# EAGLE schematic obc_old (EAGLE 9.5.0)
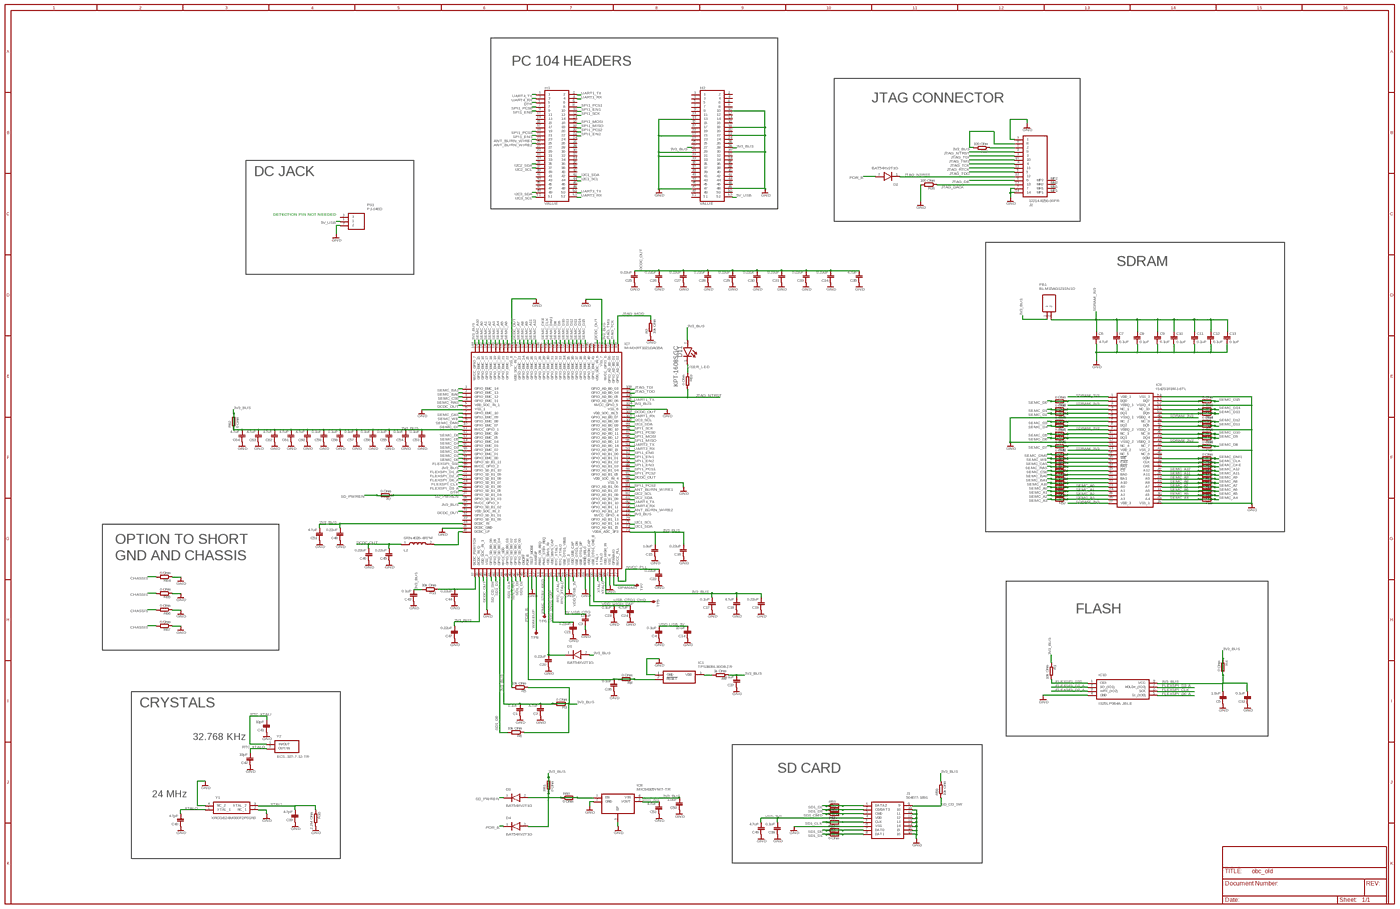
[diagram p0: schematic, sheet 1, overview]
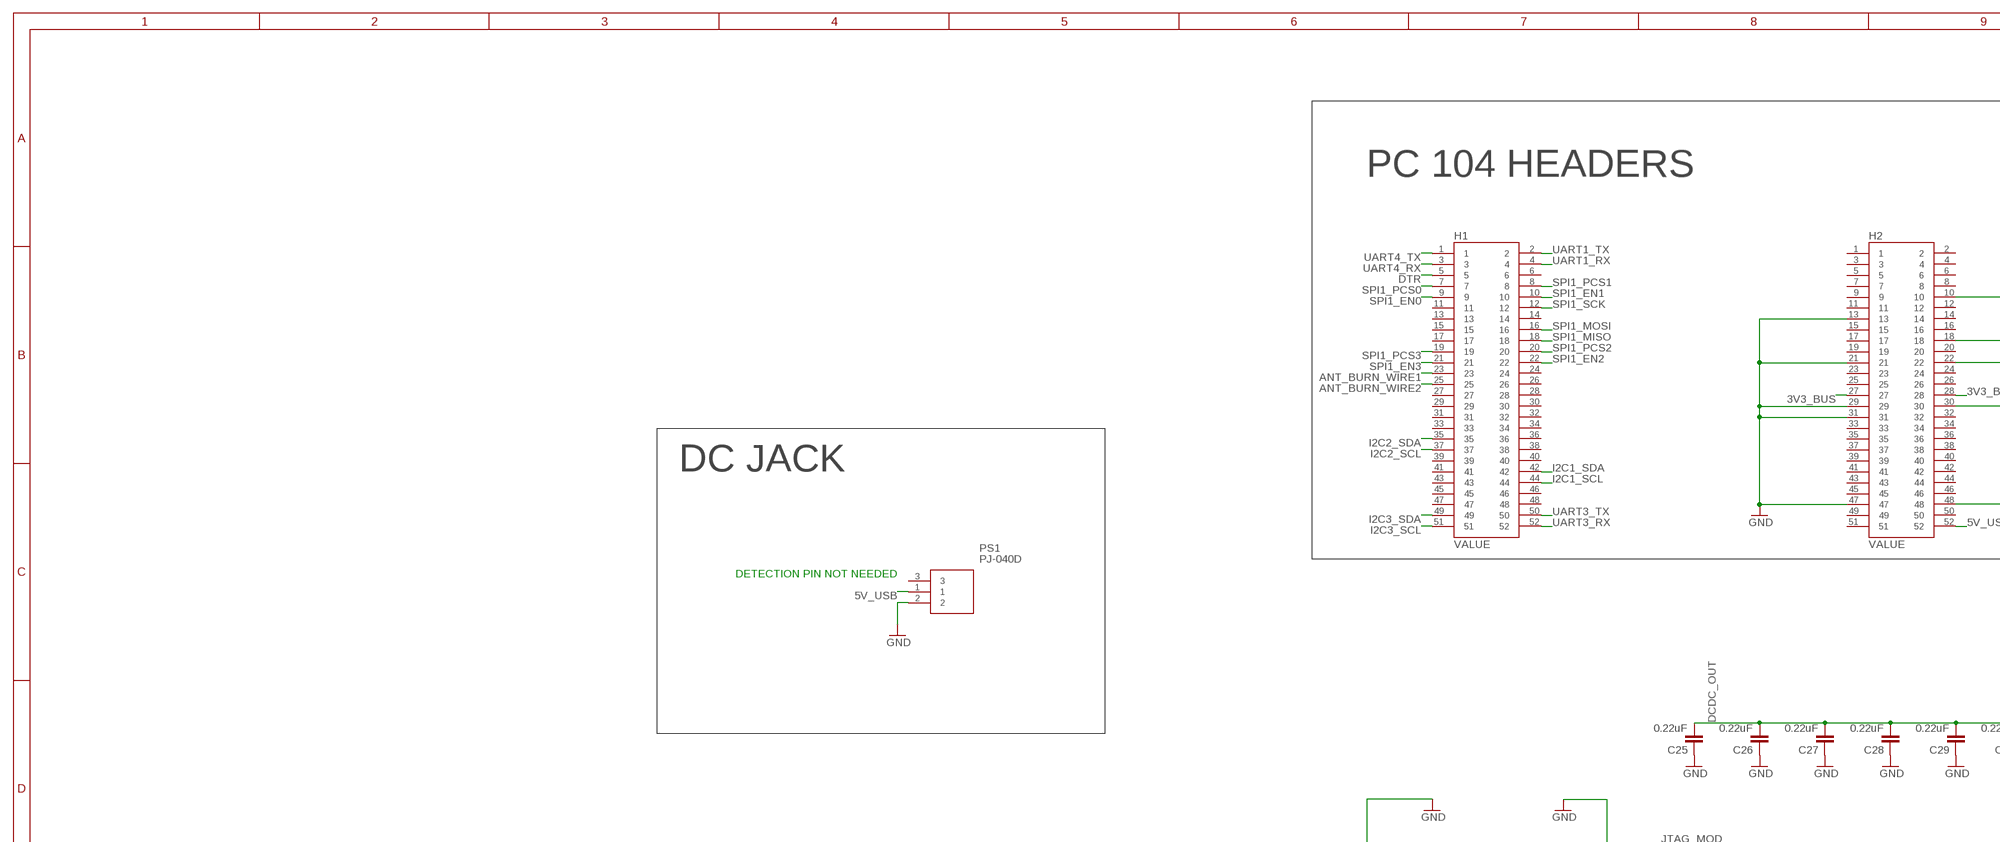
[diagram p1: schematic, sheet 1, part 1 of 4]
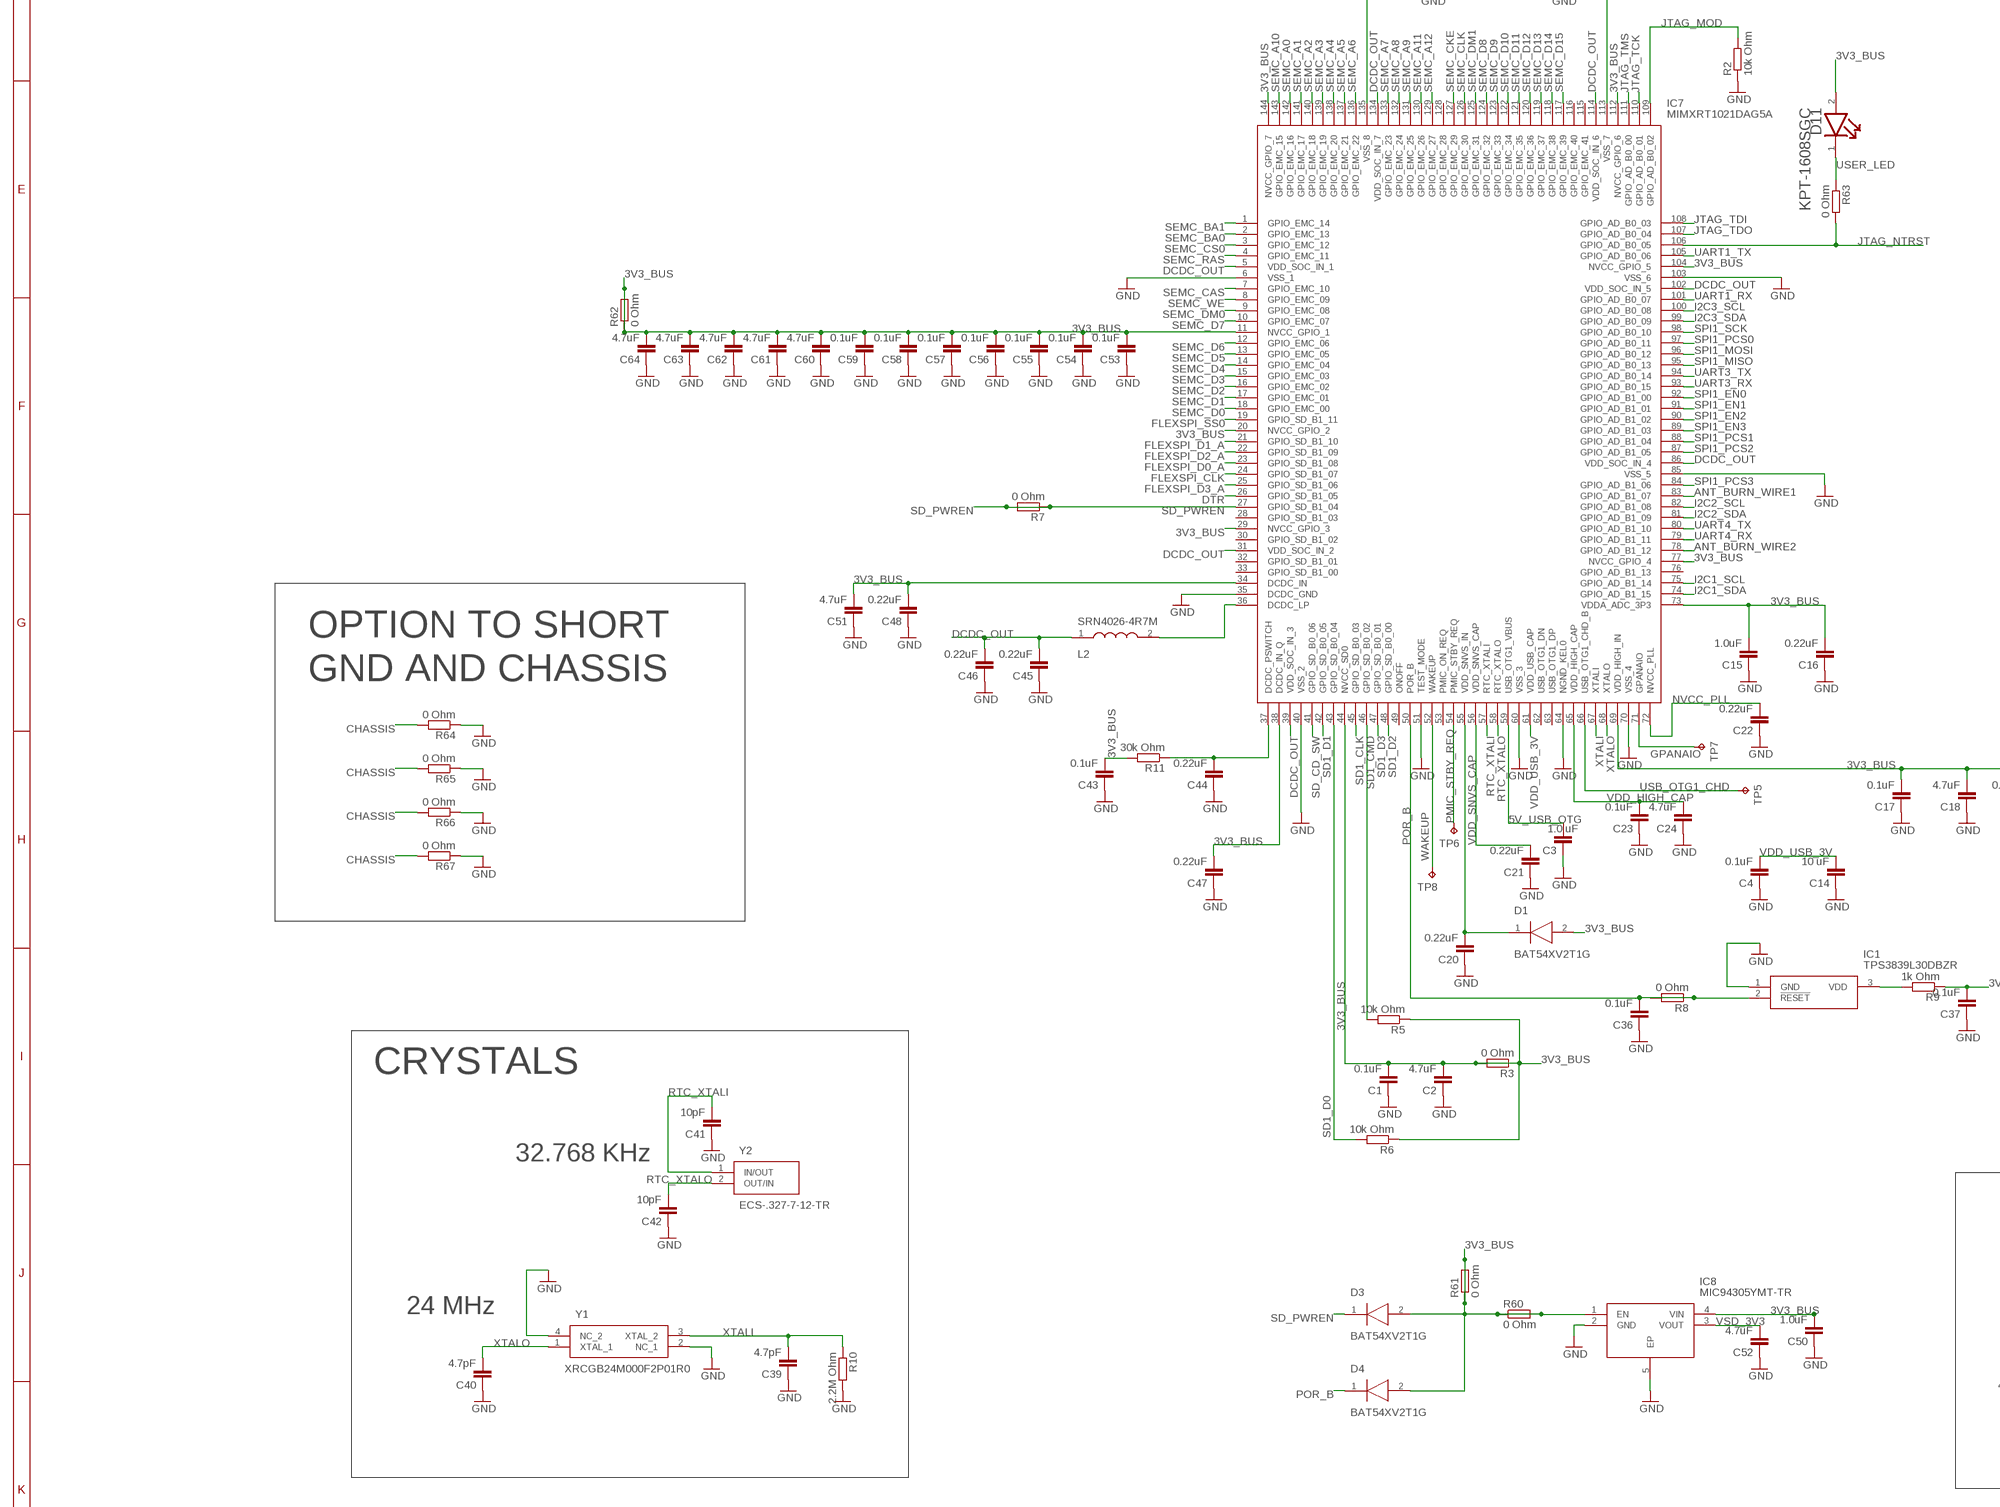
[diagram p2: schematic, sheet 1, part 2 of 4]
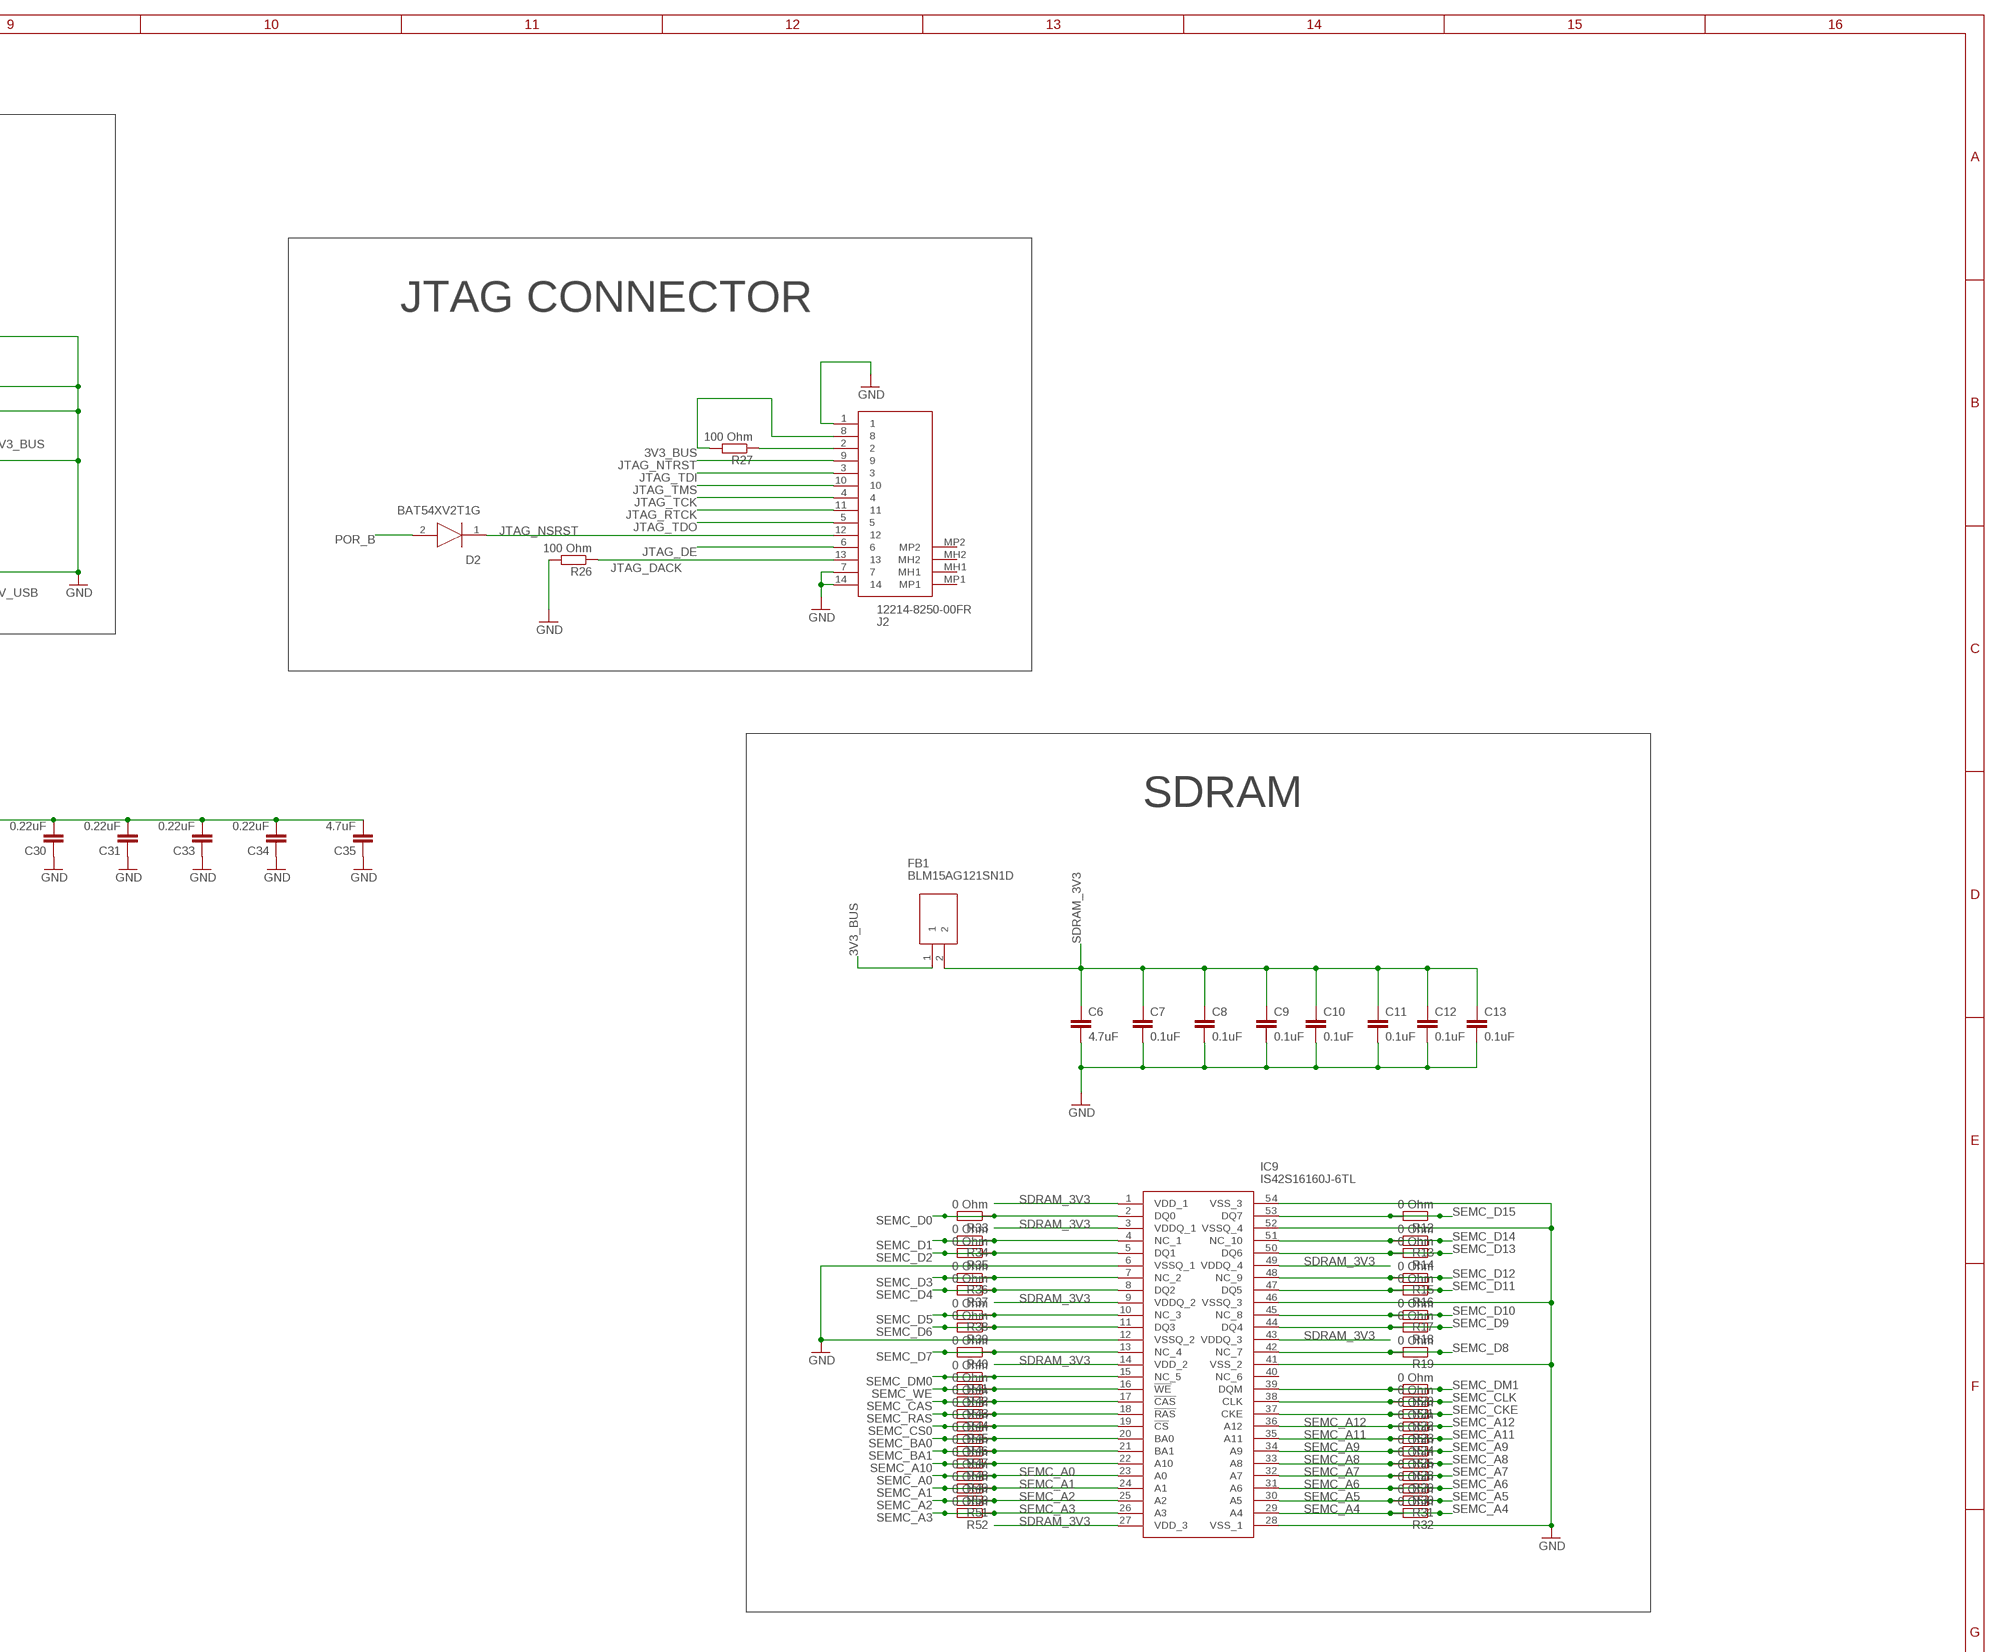
[diagram p3: schematic, sheet 1, part 3 of 4]
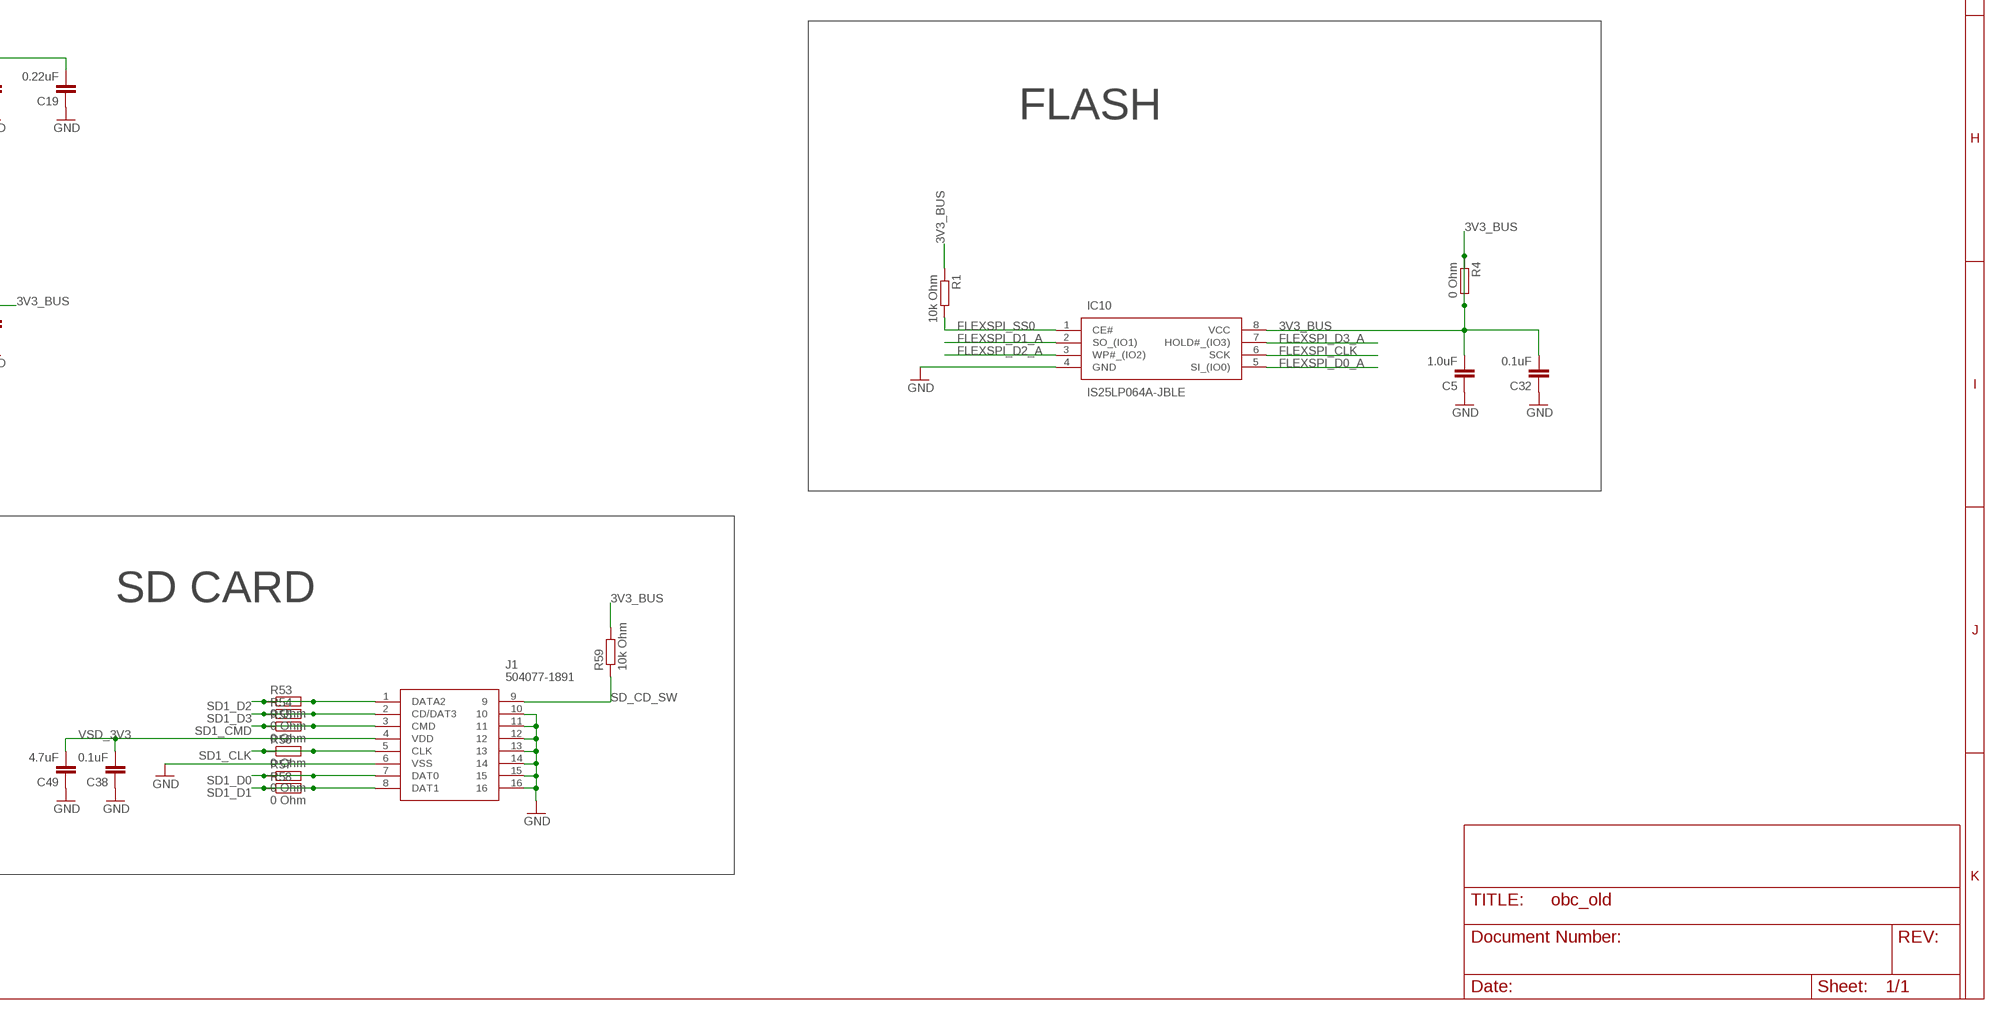
[diagram p4: schematic, sheet 1, part 4 of 4]

## Parts
C1  0.1uF  C-EUC0402K  [C0402K]
C2  4.7uF  C-EUC0402K  [C0402K]
C3  1.0 uF  C-EUC0402K  [C0402K]
C4  0.1uF  C-EUC0402K  [C0402K]
C5  1.0uF  C-EUC0402K  [C0402K]
C6  4.7uF  C-EUC0402K  [C0402K]
C7  0.1uF  C-EUC0402K  [C0402K]
C8  0.1uF  C-EUC0402K  [C0402K]
C9  0.1uF  C-EUC0402K  [C0402K]
C10  0.1uF  C-EUC0402K  [C0402K]
C11  0.1uF  C-EUC0402K  [C0402K]
C12  0.1uF  C-EUC0402K  [C0402K]
C13  0.1uF  C-EUC0402K  [C0402K]
C14  10 uF  C-EUC0402K  [C0402K]
C15  1.0uF  C-EUC0402K  [C0402K]
C16  0.22uF  C-EUC0402K  [C0402K]
C17  0.1uF  C-EUC0402K  [C0402K]
C18  4.7uF  C-EUC0402K  [C0402K]
C19  0.22uF  C-EUC0402K  [C0402K]
C20  0.22uF  C-EUC0402K  [C0402K]
C21  0.22uF  C-EUC0402K  [C0402K]
C22  0.22uF  C-EUC0402K  [C0402K]
C23  0.1uF  C-EUC0402K  [C0402K]
C24  4.7uF  C-EUC0402K  [C0402K]
C25  0.22uF  C-EUC0402K  [C0402K]
C26  0.22uF  C-EUC0402K  [C0402K]
C27  0.22uF  C-EUC0402K  [C0402K]
C28  0.22uF  C-EUC0402K  [C0402K]
C29  0.22uF  C-EUC0402K  [C0402K]
C30  0.22uF  C-EUC0402K  [C0402K]
C31  0.22uF  C-EUC0402K  [C0402K]
C32  0.1uF  C-EUC0402K  [C0402K]
C33  0.22uF  C-EUC0402K  [C0402K]
C34  0.22uF  C-EUC0402K  [C0402K]
C35  4.7uF  C-EUC0402K  [C0402K]
C36  0.1uF  C-EUC0402K  [C0402K]
C37  0.1uF  C-EUC0402K  [C0402K]
C38  0.1uF  C-EUC0402K  [C0402K]
C39  4.7pF  C-EUC0402K  [C0402K]
C40  4.7pF  C-EUC0402K  [C0402K]
C41  10pF  C-EUC0402K  [C0402K]
C42  10pF  C-EUC0402K  [C0402K]
C43  0.1uF  C-EUC0402K  [C0402K]
C44  0.22uF  C-EUC0402K  [C0402K]
C45  0.22uF  C-EUC0402K  [C0402K]
C46  0.22uF  C-EUC0402K  [C0402K]
C47  0.22uF  C-EUC0402K  [C0402K]
C48  0.22uF  C-EUC0402K  [C0402K]
C49  4.7uF  C-EUC0402K  [C0402K]
C50  1.0uF  C-EUC0402K  [C0402K]
C51  4.7uF  C-EUC0402K  [C0402K]
C52  4.7uF  C-EUC0402K  [C0402K]
C53  0.1uF  C-EUC0402K  [C0402K]
C54  0.1uF  C-EUC0402K  [C0402K]
C55  0.1uF  C-EUC0402K  [C0402K]
C56  0.1uF  C-EUC0402K  [C0402K]
C57  0.1uF  C-EUC0402K  [C0402K]
C58  0.1uF  C-EUC0402K  [C0402K]
C59  0.1uF  C-EUC0402K  [C0402K]
C60  4.7uF  C-EUC0402K  [C0402K]
C61  4.7uF  C-EUC0402K  [C0402K]
C62  4.7uF  C-EUC0402K  [C0402K]
C63  4.7uF  C-EUC0402K  [C0402K]
C64  4.7uF  C-EUC0402K  [C0402K]
D1  BAT54XV2T1G  [SODFL1608X70N]
D2  BAT54XV2T1G  [SODFL1608X70N]
D3  BAT54XV2T1G  [SODFL1608X70N]
D4  BAT54XV2T1G  [SODFL1608X70N]
D11  KINGBRIGHT_KPT-1608SGCKINGBRIGHT_KPT-1608SGC_0_0  [KINGBRIGHT_KPT-1608SGC_0]
FB1  BLM15AG121SN1D  [NFZ15SG152SN10B]
H1  ESQ-126-39-G-D  [SAMTEC_ESQ-126-39-G-D]
H2  ESQ-126-39-G-D  [SAMTEC_ESQ-126-39-G-D]
IC1  TPS3839L30DBZR  [SOT95P237X112-3N]
IC7  MIMXRT1021DAG5A  [QFP50P2200X2200X160-144N]
IC8  MIC94305YMT-TR  [SON50P160X120X60-5N]
IC9  IS42S16160J-6TL  [SOP80P1176X120-54N]
IC10  IS25LP064A-JBLE  [SOIC127P790X216-8N]
J1  504077-1891  [5040771891]
J2  12214-8250-00FR  [12214825000FR]
L2  SRN4026-4R7M  [SRN4026]
PS1  PJ-040D  [PJ040D]
R1  10k Ohm  R-EU_R0402  [R0402]
R2  10k Ohm  R-EU_R0402  [R0402]
R3  0 Ohm  R-EU_R0402  [R0402]
R4  0 Ohm  R-EU_R0402  [R0402]
R5  10k Ohm  R-EU_R0402  [R0402]
R6  10k Ohm  R-EU_R0402  [R0402]
R7  0 Ohm  R-EU_R0402  [R0402]
R8  0 Ohm  R-EU_R0402  [R0402]
R9  1k Ohm  R-EU_R0402  [R0402]
R10  2.2M Ohm  R-EU_R0402  [R0402]
R11  30k Ohm  R-EU_R0402  [R0402]
R12  0 Ohm  R-EU_R0402  [R0402]
R13  0 Ohm  R-EU_R0402  [R0402]
R14  0 Ohm  R-EU_R0402  [R0402]
R15  0 Ohm  R-EU_R0402  [R0402]
R16  0 Ohm  R-EU_R0402  [R0402]
R17  0 Ohm  R-EU_R0402  [R0402]
R18  0 Ohm  R-EU_R0402  [R0402]
R19  0 Ohm  R-EU_R0402  [R0402]
R20  0 Ohm  R-EU_R0402  [R0402]
R21  0 Ohm  R-EU_R0402  [R0402]
R22  0 Ohm  R-EU_R0402  [R0402]
R23  0 Ohm  R-EU_R0402  [R0402]
R24  0 Ohm  R-EU_R0402  [R0402]
R25  0 Ohm  R-EU_R0402  [R0402]
R26  100 Ohm  R-EU_R0402  [R0402]
R27  100 Ohm  R-EU_R0402  [R0402]
R28  0 Ohm  R-EU_R0402  [R0402]
R29  0 Ohm  R-EU_R0402  [R0402]
R30  0 Ohm  R-EU_R0402  [R0402]
R31  0 Ohm  R-EU_R0402  [R0402]
R32  0 Ohm  R-EU_R0402  [R0402]
R33  0 Ohm  R-EU_R0402  [R0402]
R34  0 Ohm  R-EU_R0402  [R0402]
R35  0 Ohm  R-EU_R0402  [R0402]
R36  0 Ohm  R-EU_R0402  [R0402]
R37  0 Ohm  R-EU_R0402  [R0402]
R38  0 Ohm  R-EU_R0402  [R0402]
R39  0 Ohm  R-EU_R0402  [R0402]
R40  0 Ohm  R-EU_R0402  [R0402]
R41  0 Ohm  R-EU_R0402  [R0402]
R42  0 Ohm  R-EU_R0402  [R0402]
R43  0 Ohm  R-EU_R0402  [R0402]
R44  0 Ohm  R-EU_R0402  [R0402]
R45  0 Ohm  R-EU_R0402  [R0402]
R46  0 Ohm  R-EU_R0402  [R0402]
R47  0 Ohm  R-EU_R0402  [R0402]
R48  0 Ohm  R-EU_R0402  [R0402]
R49  0 Ohm  R-EU_R0402  [R0402]
R50  0 Ohm  R-EU_R0402  [R0402]
R51  0 Ohm  R-EU_R0402  [R0402]
R52  0 Ohm  R-EU_R0402  [R0402]
R53  0 Ohm  R-EU_R0402  [R0402]
R54  0 Ohm  R-EU_R0402  [R0402]
R55  0 Ohm  R-EU_R0402  [R0402]
R56  0 Ohm  R-EU_R0402  [R0402]
R57  0 Ohm  R-EU_R0402  [R0402]
R58  0 Ohm  R-EU_R0402  [R0402]
R59  10k Ohm  R-EU_R0402  [R0402]
R60  0 Ohm  R-EU_R0402  [R0402]
R61  0 Ohm  R-EU_R0402  [R0402]
R62  0 Ohm  R-EU_R0402  [R0402]
R63  0 Ohm  R-EU_R0402  [R0402]
R64  0 Ohm  R-EU_R0402  [R0402]
R65  0 Ohm  R-EU_R0402  [R0402]
R66  0 Ohm  R-EU_R0402  [R0402]
R67  0 Ohm  R-EU_R0402  [R0402]
TP5  TPTP06R  [TP06R]
TP6  TPTP06R  [TP06R]
TP7  TPTP06R  [TP06R]
TP8  TPTP06R  [TP06R]
Y1  XRCGB24M000F2P01R0  [XRCGB24M000F2P01R0]
Y2  ECS-.327-7-12-TR  [ECS327712TR]

## Nets
3V3_BUS: C1.2 C2.2 C5.2 C15.2 C16.2 C17.2 C18.2 C19.2 C32.2 C37.2 C43.2 C47.2 C48.2 C50.2 C51.2 C53.2 C54.2 C55.2 C56.2 C57.2 C58.2 C59.2 C60.2 C61.2 C62.2 C63.2 C64.2 D1.2(A) D3.2(A) D4.2(A) D11.2(ANODE) FB1.1 H2.27 H2.28 IC7.11(NVCC_GPIO_1) IC7.20(NVCC_GPIO_2) IC7.29(NVCC_GPIO_3) IC7.34(DCDC_IN) IC7.38(DCDC_IN_Q) IC7.44(NVCC_SD0) IC7.69(VDD_HIGH_IN) IC7.73(VDDA_ADC_3P3) IC7.77(NVCC_GPIO_4) IC7.104(NVCC_GPIO_5) IC7.112(NVCC_GPIO_6) IC7.144(NVCC_GPIO_7) IC8.1(EN) IC8.4(VIN) IC10.8(VCC) J2.8 R1.1 R3.1 R3.2 R4.1 R4.2 R5.1 R6.1 R9.1 R11.2 R27.2 R59.2 R60.1 R60.2 R61.1 R61.2 R62.1 R62.2
5V_USB: H2.52 PS1.1
5V_USB_OTG: C3.2 IC7.59(USB_OTG1_VBUS)
ANT_BURN_WIRE1: H1.23 IC7.83(GPIO_AD_B1_07)
ANT_BURN_WIRE2: H1.25 IC7.78(GPIO_AD_B1_12)
CHASSIS: R64.2 R65.2 R66.2 R67.2
DCDC_OUT: C25.2 C26.2 C27.2 C28.2 C29.2 C30.2 C31.2 C33.2 C34.2 C35.2 C45.2 C46.2 IC7.5(VDD_SOC_IN_1) IC7.31(VDD_SOC_IN_2) IC7.39(VDD_SOC_IN_3) IC7.86(VDD_SOC_IN_4) IC7.102(VDD_SOC_IN_5) IC7.114(VDD_SOC_IN_6) IC7.134(VDD_SOC_IN_7) L2.1
DTR: H1.5 IC7.26(GPIO_SD_B1_05)
FLEXSPI_CLK: IC7.24(GPIO_SD_B1_07) IC10.6(SCK)
FLEXSPI_D0_A: IC7.23(GPIO_SD_B1_08) IC10.5(SI_(IO0))
FLEXSPI_D1_A: IC7.21(GPIO_SD_B1_10) IC10.2(SO_(IO1))
FLEXSPI_D2_A: IC7.22(GPIO_SD_B1_09) IC10.3(WP#_(IO2))
FLEXSPI_D3_A: IC7.25(GPIO_SD_B1_06) IC10.7(HOLD#_(IO3))
FLEXSPI_SS0: IC7.19(GPIO_SD_B1_11) IC10.1(CE#) R1.2
GND: C1.1 C2.1 C3.1 C4.1 C5.1 C6.2 C7.2 C8.2 C9.2 C10.2 C11.2 C12.2 C13.2 C14.1 C15.1 C16.1 C17.1 C18.1 C19.1 C20.1 C21.1 C22.1 C23.1 C24.1 C25.1 C26.1 C27.1 C28.1 C29.1 C30.1 C31.1 C32.1 C33.1 C34.1 C35.1 C36.1 C37.1 C38.1 C39.1 C40.1 C41.1 C42.1 C43.1 C44.1 C45.1 C46.1 C47.1 C48.1 C49.1 C50.1 C51.1 C52.1 C53.1 C54.1 C55.1 C56.1 C57.1 C58.1 C59.1 C60.1 C61.1 C62.1 C63.1 C64.1 H2.10 H2.13 H2.18 H2.21 H2.22 H2.29 H2.30 H2.31 H2.47 H2.48 IC1.1(GND) IC7.6(VSS_1) IC7.35(DCDC_GND) IC7.40(VSS_2) IC7.51(TEST_MODE) IC7.60(VSS_3) IC7.64(NGND_KEL0) IC7.70(VSS_4) IC7.85(VSS_5) IC7.103(VSS_6) IC7.113(VSS_7) IC7.135(VSS_8) IC8.2(GND) IC8.5(EP) IC9.6(VSSQ_1) IC9.12(VSSQ_2) IC9.28(VSS_1) IC9.41(VSS_2) IC9.46(VSSQ_3) IC9.52(VSSQ_4) IC9.54(VSS_3) IC10.4(GND) J1.6(VSS) J1.10 J1.11 J1.12 J1.13 J1.14 J1.15 J1.16 J2.1 J2.7 J2.14 PS1.2 R2.1 R10.2 R26.2 R64.1 R65.1 R66.1 R67.1 Y1.2(NC_1) Y1.4(NC_2)
GPANAIO: IC7.71(GPANAIO) TP7.TP
I2C1_SCL: H1.44 IC7.75(GPIO_AD_B1_14)
I2C1_SDA: H1.42 IC7.74(GPIO_AD_B1_15)
I2C2_SCL: H1.37 IC7.82(GPIO_AD_B1_08)
I2C2_SDA: H1.35 IC7.81(GPIO_AD_B1_09)
I2C3_SCL: H1.51 IC7.100(GPIO_AD_B0_08)
I2C3_SDA: H1.49 IC7.99(GPIO_AD_B0_09)
JTAG_DACK: J2.13 R26.1
JTAG_DE: J2.6
JTAG_MOD: IC7.109(GPIO_AD_B0_02) R2.2
JTAG_NSRST: D2.1(K) J2.12
JTAG_NTRST: IC7.106(GPIO_AD_B0_05) J2.9 R63.2
JTAG_RTCK: J2.11
JTAG_TCK: IC7.110(GPIO_AD_B0_01) J2.4
JTAG_TDI: IC7.108(GPIO_AD_B0_03) J2.3
JTAG_TDO: IC7.107(GPIO_AD_B0_04) J2.5
JTAG_TMS: IC7.111(GPIO_AD_B0_00) J2.10
N$3: IC1.3(VDD) R9.2
N$36: IC7.36(DCDC_LP) L2.2
N$38: J2.2 R27.1
N$41: C44.2 IC7.37(DCDC_PSWITCH) R11.1
N$59: C20.2 D1.1(K) IC7.55(VDD_SNVS_IN)
NVCC_PLL: C22.2 IC7.72(NVCC_PLL)
PMIC_STBY_REQ: IC7.54(PMIC_STBY_REQ) TP6.TP
POR_B: C36.2 D2.2(A) D4.1(K) IC1.2(!RESET) IC7.50(POR_B) R8.1 R8.2
RTC_XTALI: C41.2 IC7.57(RTC_XTALI) Y2.1(IN/OUT)
RTC_XTALO: C42.2 IC7.58(RTC_XTALO) Y2.2(OUT/IN)
SD1_CLK: IC7.45(GPIO_SD_B0_03) J1.5(CLK) R56.1 R56.2
SD1_CMD: IC7.46(GPIO_SD_B0_02) J1.3(CMD) R5.2 R55.1 R55.2
SD1_D0: IC7.43(GPIO_SD_B0_04) J1.7(DAT0) R6.2 R57.1 R57.2
SD1_D1: IC7.42(GPIO_SD_B0_05) J1.8(DAT1) R58.1 R58.2
SD1_D2: IC7.48(GPIO_SD_B0_00) J1.1(DATA2) R53.1 R53.2
SD1_D3: IC7.47(GPIO_SD_B0_01) J1.2(CD/DAT3) R54.1 R54.2
SD_CD_SW: IC7.41(GPIO_SD_B0_06) J1.9 R59.1
SD_PWREN: D3.1(K) IC7.27(GPIO_SD_B1_04) R7.1 R7.2
SDRAM_3V3: C6.1 C7.1 C8.1 C9.1 C10.1 C11.1 C12.1 C13.1 FB1.2 IC9.1(VDD_1) IC9.3(VDDQ_1) IC9.9(VDDQ_2) IC9.14(VDD_2) IC9.27(VDD_3) IC9.43(VDDQ_3) IC9.49(VDDQ_4)
SEMC_A0: IC7.142(GPIO_EMC_16) IC9.23(A0) R49.1 R49.2
SEMC_A1: IC7.141(GPIO_EMC_17) IC9.24(A1) R50.1 R50.2
SEMC_A2: IC7.140(GPIO_EMC_18) IC9.25(A2) R51.1 R51.2
SEMC_A3: IC7.139(GPIO_EMC_19) IC9.26(A3) R52.1 R52.2
SEMC_A4: IC7.138(GPIO_EMC_20) IC9.29(A4) R32.1 R32.2
SEMC_A5: IC7.137(GPIO_EMC_21) IC9.30(A5) R31.1 R31.2
SEMC_A6: IC7.136(GPIO_EMC_22) IC9.31(A6) R30.1 R30.2
SEMC_A7: IC7.133(GPIO_EMC_23) IC9.32(A7) R29.1 R29.2
SEMC_A8: IC7.132(GPIO_EMC_24) IC9.33(A8) R28.1 R28.2
SEMC_A9: IC7.131(GPIO_EMC_25) IC9.34(A9) R25.1 R25.2
SEMC_A10: IC7.143(GPIO_EMC_15) IC9.22(A10) R48.1 R48.2
SEMC_A11: IC7.130(GPIO_EMC_26) IC9.35(A11) R24.1 R24.2
SEMC_A12: IC7.129(GPIO_EMC_27) IC9.36(A12) R23.1 R23.2
SEMC_BA0: IC7.2(GPIO_EMC_13) IC9.20(BA0) R46.1 R46.2
SEMC_BA1: IC7.1(GPIO_EMC_14) IC9.21(BA1) R47.1 R47.2
SEMC_CAS: IC7.7(GPIO_EMC_10) IC9.17(!CAS) R43.1 R43.2
SEMC_CKE: IC7.127(GPIO_EMC_29) IC9.37(CKE) R22.1 R22.2
SEMC_CLK: IC7.126(GPIO_EMC_30) IC9.38(CLK) R21.1 R21.2
SEMC_CS0: IC7.3(GPIO_EMC_12) IC9.19(!CS) R45.1 R45.2
SEMC_D0: IC7.18(GPIO_EMC_00) IC9.2(DQ0) R33.1 R33.2
SEMC_D1: IC7.17(GPIO_EMC_01) IC9.4(NC_1) R34.1 R34.2
SEMC_D2: IC7.16(GPIO_EMC_02) IC9.5(DQ1) R35.1 R35.2
SEMC_D3: IC7.15(GPIO_EMC_03) IC9.7(NC_2) R36.1 R36.2
SEMC_D4: IC7.14(GPIO_EMC_04) IC9.8(DQ2) R37.1 R37.2
SEMC_D5: IC7.13(GPIO_EMC_05) IC9.10(NC_3) R38.1 R38.2
SEMC_D6: IC7.12(GPIO_EMC_06) IC9.11(DQ3) R39.1 R39.2
SEMC_D7: IC7.10(GPIO_EMC_07) IC9.13(NC_4) R40.1 R40.2
SEMC_D8: IC7.124(GPIO_EMC_32) IC9.42(NC_7) R19.1 R19.2
SEMC_D9: IC7.123(GPIO_EMC_33) IC9.44(DQ4) R18.1 R18.2
SEMC_D10: IC7.122(GPIO_EMC_34) IC9.45(NC_8) R17.1 R17.2
SEMC_D11: IC7.121(GPIO_EMC_35) IC9.47(DQ5) R16.1 R16.2
SEMC_D12: IC7.120(GPIO_EMC_36) IC9.48(NC_9) R15.1 R15.2
SEMC_D13: IC7.119(GPIO_EMC_37) IC9.50(DQ6) R14.1 R14.2
SEMC_D14: IC7.118(GPIO_EMC_38) IC9.51(NC_10) R13.1 R13.2
SEMC_D15: IC7.117(GPIO_EMC_39) IC9.53(DQ7) R12.1 R12.2
SEMC_DM0: IC7.9(GPIO_EMC_08) IC9.15(NC_5) R41.1 R41.2
SEMC_DM1: IC7.125(GPIO_EMC_31) IC9.39(DQM) R20.1 R20.2
SEMC_RAS: IC7.4(GPIO_EMC_11) IC9.18(!RAS) R44.1 R44.2
SEMC_WE: IC7.8(GPIO_EMC_09) IC9.16(!WE) R42.1 R42.2
SPI1_EN0: H1.9 IC7.92(GPIO_AD_B1_00)
SPI1_EN1: H1.10 IC7.91(GPIO_AD_B1_01)
SPI1_EN2: H1.22 IC7.90(GPIO_AD_B1_02)
SPI1_EN3: H1.21 IC7.89(GPIO_AD_B1_03)
SPI1_MISO: H1.18 IC7.95(GPIO_AD_B0_13)
SPI1_MOSI: H1.16 IC7.96(GPIO_AD_B0_12)
SPI1_PCS0: H1.7 IC7.97(GPIO_AD_B0_11)
SPI1_PCS1: H1.8 IC7.88(GPIO_AD_B1_04)
SPI1_PCS2: H1.20 IC7.87(GPIO_AD_B1_05)
SPI1_PCS3: H1.19 IC7.84(GPIO_AD_B1_06)
SPI1_SCK: H1.12 IC7.98(GPIO_AD_B0_10)
UART1_RX: H1.4 IC7.101(GPIO_AD_B0_07)
UART1_TX: H1.2 IC7.105(GPIO_AD_B0_06)
UART3_RX: H1.52 IC7.93(GPIO_AD_B0_15)
UART3_TX: H1.50 IC7.94(GPIO_AD_B0_14)
UART4_RX: H1.3 IC7.79(GPIO_AD_B1_11)
UART4_TX: H1.1 IC7.80(GPIO_AD_B1_10)
USB_OTG1_CHD: IC7.66(USB_OTG1_CHD_B) TP5.TP
USER_LED: D11.1(CATHODE) R63.1
VDD_HIGH_CAP: C23.2 C24.2 IC7.65(VDD_HIGH_CAP)
VDD_SNVS_CAP: C21.2 IC7.56(VDD_SNVS_CAP)
VDD_USB_3V: C4.2 C14.2 IC7.61(VDD_USB_CAP)
VSD_3V3: C38.2 C49.2 C52.2 IC8.3(VOUT) J1.4(VDD)
WAKEUP: IC7.52(WAKEUP) TP8.TP
XTALI: C39.2 IC7.67(XTALI) R10.1 Y1.3(XTAL_2)
XTALO: C40.2 IC7.68(XTALO) Y1.1(XTAL_1)
Unconnected: H1.6 H1.11 H1.13 H1.14 H1.15 H1.17 H1.24 H1.26 H1.27 H1.28 H1.29 H1.30 H1.31 H1.32 H1.33 H1.34 H1.36 H1.38 H1.39 H1.40 H1.41 H1.43 H1.45 H1.46 H1.47 H1.48 H2.1 H2.2 H2.3 H2.4 H2.5 H2.6 H2.7 H2.8 H2.9 H2.11 H2.12 H2.14 H2.15 H2.16 H2.17 H2.19 H2.20 H2.23 H2.24 H2.25 H2.26 H2.32 H2.33 H2.34 H2.35 H2.36 H2.37 H2.38 H2.39 H2.40 H2.41 H2.42 H2.43 H2.44 H2.45 H2.46 H2.49 H2.50 H2.51 IC7.28(GPIO_SD_B1_03) IC7.30(GPIO_SD_B1_02) IC7.32(GPIO_SD_B1_01) IC7.33(GPIO_SD_B1_00) IC7.49(ONOFF) IC7.53(PMIC_ON_REQ) IC7.62(USB_OTG1_DN) IC7.63(USB_OTG1_DP) IC7.76(GPIO_AD_B1_13) IC7.115(GPIO_EMC_41) IC7.116(GPIO_EMC_40) IC7.128(GPIO_EMC_28) IC9.40(NC_6) J2.MH1 J2.MH2 J2.MP1 J2.MP2 PS1.3

## Notes on the sheet
- PC 104 HEADERS
- JTAG CONNECTOR
- DC JACK
- DETECTION PIN NOT NEEDED
- SDRAM
- OPTION TO SHORT
- GND AND CHASSIS
- FLASH
- CRYSTALS
- 32.768 KHz
- SD CARD
- 24 MHz

## Library data of the parts
C1-C64 = rcl:C-EU: CAPACITOR, European symbol; SPICEPREFIX: C
D1-D4 = BAT54XV2T1G:BAT54XV2T1G: Diode Schottky 30V 0.2A 5ns SOD-523 ON Semiconductor BAT54XV2T1G Schottky Diode, 0.2A, 30V, 5ns, 2-Pin SOD-523 Source: Datasheet <http://www.onsemi.com/pub/Collateral/BAT54XV2T1-D.PDF>; DESCRIPTION: Diode Schottky 30V 0.2A 5ns SOD-523 ON Semiconductor BAT54XV2T1G Schottky Diode, 0.2A, 30V, 5ns, 2-Pin SOD-523; HEIGHT: 0.7mm; MANUFACTURER_NAME: ON Semiconductor; MANUFACTURER_PART_NUMBER: BAT54XV2T1G; MOUSER_PART_NUMBER: 863-BAT54XV2T1G; MOUSER_PRICE-STOCK: https://www.mouser.co.uk/ProductDetail/ON-Semiconductor/BAT54XV2T1G?qs=vLkC5FC1VN8vpceP7xcdrw%3D%3D
D11 = Kingbright - KPT-1608SGC:KINGBRIGHT_KPT-1608SGC: LED, Low Power, Green, SMD, 20 mA, 2.2 V, 568 nm; CENTROID_NOT_SPECIFIED: No; COLOUR: Green; DATASHEET: http://www.kingbright.com/attachments/file/psearch/000/00/00/KPT-1608SGC(Ver.29B).pdf; DEVICE_CLASS_L1: Optoelectronics; DEVICE_CLASS_L2: LEDs; DEVICE_CLASS_L3: unset; FORWARD_CURRENT: 25mA; FORWARD_VOLTAGE: 2.2V; HEIGHT: 0.85mm; LEAD_FREE: yes; LED_ORIENTATION: Top View; LUMINOUS_INTENSITY: 12mcd; MAX_JUNCTION_TEMP: +110°C; MF: Kingbright; MFG_PACKAGE_IDENT: KPT-1608SGC; MFG_PACKAGE_IDENT_DATE: 0; MFG_PACKAGE_IDENT_REV: 0; MPN: KPT-1608SGC; PACKAGE: 0603; POWER_DISSIPATION: 62.5mW; PREFIX: D; REVERSE_VOLTAGE: 5V; ROHS: yes; TEMPERATURE_RANGE_HIGH: +85°C; TEMPERATURE_RANGE_LOW: -40°C; VERIFICATION_VERSION: 0.0.0.1; VIEWING_ANGLE: 150°; WAVELENGTH: 568nm
FB1 = BLM15AG121SN1D:BLM15AG121SN1D: Ferrite bead SMD 0402 120R 500mA Murata Ferrite Bead (Chip Ferrite Bead), 1 x 0.5 x 0.5mm (0402), 120 impedance at 100 MHz Source: Datasheet <https://www.murata.com/en-us/products/productdetail?partno=BLM15AG121SN1#>; DESCRIPTION: Ferrite bead SMD 0402 120R 500mA Murata Ferrite Bead (Chip Ferrite Bead), 1 x 0.5 x 0.5mm (0402), 120 impedance at 100 MHz; HEIGHT: 0.55mm; MANUFACTURER_NAME: Murata Electronics; MANUFACTURER_PART_NUMBER: BLM15AG121SN1D; MOUSER_PART_NUMBER: 81-BLM15AG121SN1D; MOUSER_PRICE-STOCK: https://www.mouser.co.uk/ProductDetail/Murata-Electronics/BLM15AG121SN1D?qs=0mZ9c%252Bni6FbHnpaodfEgFg%3D%3D
H1 H2 = ESQ-126-39-G-D:ESQ-126-39-G-D: Conn Elevated Socket SKT 52 POS 2.54mm Solder ST Thru-Hole Tube; DESCRIPTION: 52 Position Elevated Socket Connector Through Hole; DIGI-KEY_PART_NUMBER: SAM10462-ND; DIGI-KEY_PURCHASE_URL: https://www.digikey.com/product-detail/en/samtec-inc/ESQ-126-39-G-D/SAM10462-ND/3601055?utm_source=snapeda&utm_medium=aggregator&utm_campaign=symbol; MF: Samtec; MP: ESQ-126-39-G-D; PACKAGE: None
IC1 = TPS3839L30DBZR:TPS3839L30DBZR: Ultra-Low Power, Supply Voltage Supervisor Source: Datasheet <https://www.ti.com/lit/gpn/TPS3839>; DESCRIPTION: Ultra-Low Power, Supply Voltage Supervisor; HEIGHT: 1.12mm; MANUFACTURER_NAME: Texas Instruments; MANUFACTURER_PART_NUMBER: TPS3839L30DBZR; MOUSER_PART_NUMBER: 595-TPS3839L30DBZR; MOUSER_PRICE-STOCK: https://www.mouser.co.uk/ProductDetail/Texas-Instruments/TPS3839L30DBZR?qs=4whTb%2F0XQMhk4SkTOVaKEw%3D%3D
IC7 = MIMXRT1021DAG5A:MIMXRT1021DAG5A: Processors - Application Specialized i.MXRT1020 144LQFP Source: Datasheet <http://www.nxp.com/docs/en/data-sheet/IMXRT1020CEC.pdf>; DESCRIPTION: Processors - Application Specialized i.MXRT1020 144LQFP; HEIGHT: 1.6mm; MANUFACTURER_NAME: NXP; MANUFACTURER_PART_NUMBER: MIMXRT1021DAG5A; MOUSER_PART_NUMBER: 771-MIMXRT1021DAG5A; MOUSER_PRICE-STOCK: https://www.mouser.co.uk/ProductDetail/NXP-Semiconductors/MIMXRT1021DAG5A?qs=r5DSvlrkXmJQSAxQ927JGQ%3D%3D
IC8 = MIC94305YMT-TR:MIC94305YMT-TR: Power Switch ICs - Power Distribution 500mA Switch with Ripple Blocker Technology Source: Datasheet <https://componentsearchengine.com/Datasheets/1/MIC94305YMT-TR.pdf>; DESCRIPTION: Power Switch ICs - Power Distribution 500mA Switch with Ripple Blocker Technology; HEIGHT: 0.6mm; MANUFACTURER_NAME: Microchip; MANUFACTURER_PART_NUMBER: MIC94305YMT-TR; MOUSER_PART_NUMBER: 998-MIC94305YMTTR; MOUSER_PRICE-STOCK: https://www.mouser.com/Search/Refine.aspx?Keyword=998-MIC94305YMTTR
IC9 = IS42S16160J-6TL:IS42S16160J-6TL: DRAM 256M, 3.3V, SDRAM 16Mx16, 166MHz Source: Datasheet <http://www.issi.com/WW/pdf/42-45S83200J-16160J.pdf>; DESCRIPTION: DRAM 256M, 3.3V, SDRAM 16Mx16, 166MHz; HEIGHT: 1.2mm; MANUFACTURER_NAME: Integrated Silicon Solution Inc.; MANUFACTURER_PART_NUMBER: IS42S16160J-6TL; MOUSER_PART_NUMBER: 870-IS42S16160J-6TL; MOUSER_PRICE-STOCK: https://www.mouser.co.uk/ProductDetail/ISSI/IS42S16160J-6TL?qs=uCnMRCNammn45QFjEGyZuQ%3D%3D
IC10 = IS25LP064A-JBLE:IS25LP064A-JBLE: INTEGRATED SILICON SOLUTION (ISSI) - IS25LP064A-JBLE - NOR FLASH MEMORY 64MBIT, 133MHZ, SOIC-8 Source: Datasheet <https://componentsearchengine.com/Datasheets/1/IS25LP064A-JBLE.pdf>; DESCRIPTION: INTEGRATED SILICON SOLUTION (ISSI) - IS25LP064A-JBLE - NOR FLASH MEMORY 64MBIT, 133MHZ, SOIC-8; HEIGHT: 2.16mm; MANUFACTURER_NAME: Integrated Silicon Solution Inc.; MANUFACTURER_PART_NUMBER: IS25LP064A-JBLE; MOUSER_PART_NUMBER: N/A; MOUSER_PRICE-STOCK: https://www.mouser.com/Search/Refine.aspx?Keyword=N%2FA
J1 = 504077-1891:504077-1891: Micro SD card Connector + detect switch Micro SD card Connector + detect switch Source: Datasheet; DESCRIPTION: Micro SD card Connector + detect switch Micro SD card Connector + detect switch; HEIGHT: 1mm; MANUFACTURER_NAME: Molex; MANUFACTURER_PART_NUMBER: 504077-1891; MOUSER_PART_NUMBER: 538-504077-1891; MOUSER_PRICE-STOCK: https://www.mouser.co.uk/ProductDetail/Molex/504077-1891?qs=H5WSs0j7A8cqevxUlTiYxw%3D%3D
J2 = 12214-8250-00FR:12214-8250-00FR: D-Sub Micro-D Connectors 0.8mm 14P R/A RECEPT SMT 30u GOLD Source: Datasheet <https://componentsearchengine.com/Datasheets/1/12214-8250-00FR.pdf>; DESCRIPTION: D-Sub Micro-D Connectors 0.8mm 14P R/A RECEPT SMT 30u GOLD; HEIGHT: 5.3mm; MANUFACTURER_NAME: 3M; MANUFACTURER_PART_NUMBER: 12214-8250-00FR; MOUSER_PART_NUMBER: 517-12214-825000FR; MOUSER_PRICE-STOCK: https://www.mouser.co.uk/ProductDetail/3M-Electronic-Solutions-Division/12214-8250-00FR?qs=9ksnFUyBSYytHybLYSpAmg%3D%3D
L2 = SRN4026-4R7M:SRN4026-4R7M: Bourns SRN4026 Series Shielded Wire-wound SMD Inductor with a Ferrite Core, 4.7 uH +/-20% 1.4A Idc Source: Datasheet <https://www.bourns.com/docs/Product-Datasheets/SRN4026.pdf>; DESCRIPTION: Bourns SRN4026 Series Shielded Wire-wound SMD Inductor with a Ferrite Core, 4.7 uH +/-20% 1.4A Idc; HEIGHT: mm; MANUFACTURER_NAME: Bourns; MANUFACTURER_PART_NUMBER: SRN4026-4R7M; MOUSER_PART_NUMBER: 652-SRN4026-4R7M; MOUSER_PRICE-STOCK: https://www.mouser.co.uk/ProductDetail/Bourns/SRN4026-4R7M?qs=U0ECReq1GB%2FUCz6YoTEwsQ%3D%3D
PS1 = PJ-040D:PJ-040D: DC Power Connectors Source: Datasheet <https://componentsearchengine.com/Datasheets/1/PJ-040D.pdf>; DESCRIPTION: DC Power Connectors; HEIGHT: 5mm; MANUFACTURER_NAME: CUI Devices; MANUFACTURER_PART_NUMBER: PJ-040D; MOUSER_PART_NUMBER: 490-PJ-040D; MOUSER_PRICE-STOCK: https://www.mouser.com/Search/Refine.aspx?Keyword=490-PJ-040D
R1-R67 = rcl:R-EU_: RESISTOR, European symbol; SPICEPREFIX: R
TP5-TP8 = testpad:TP: Test pad
Y1 = XRCGB24M000F2P01R0:XRCGB24M000F2P01R0: 2.0x1.6x0.65mm 24MHz Crystal +/-20ppm Initial tolerance Source: Datasheet <https://componentsearchengine.com/Datasheets/1/XRCGB24M000F2P01R0.pdf>; DESCRIPTION: 2.0x1.6x0.65mm 24MHz Crystal +/-20ppm Initial tolerance; HEIGHT: 0.7mm; MANUFACTURER_NAME: Murata Electronics; MANUFACTURER_PART_NUMBER: XRCGB24M000F2P01R0; MOUSER_PART_NUMBER: 81-XRCGB24M000F2P01R; MOUSER_PRICE-STOCK: https://www.mouser.com/Search/Refine.aspx?Keyword=81-XRCGB24M000F2P01R
Y2 = ECS-.327-7-12-TR:ECS-.327-7-12-TR: Crystals 32.768KHz 7pF Source: Datasheet <https://www.ecsxtal.com/store/pdf/ECX_12.pdf>; DESCRIPTION: Crystals 32.768KHz 7pF; HEIGHT: 0.6mm; MANUFACTURER_NAME: ECS; MANUFACTURER_PART_NUMBER: ECS-.327-7-12-TR; MOUSER_PART_NUMBER: 520-ECS-.327-7-12-TR; MOUSER_PRICE-STOCK: https://www.mouser.co.uk/ProductDetail/ECS/ECS-327-7-12-TR?qs=wo4x%252BUeoG8UnhrSkJ%252BdUcw%3D%3D